# Altium schematic sheet Power.SchDoc
size A4
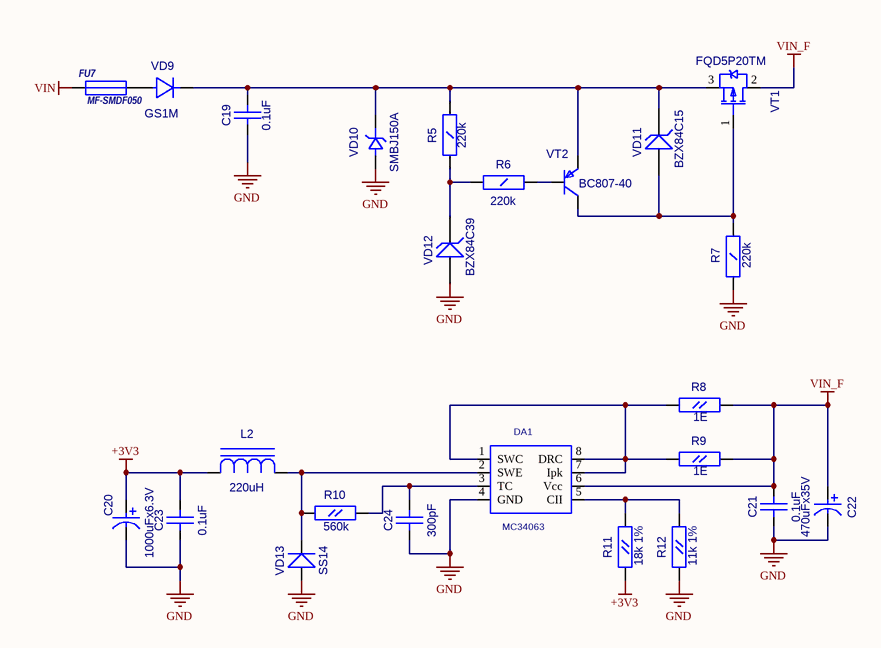
[diagram p0: Power.SchDoc]

## Parts
C19  0.1uF  [CC1206]
C20  1000uFx6.3V  [CC8X3.5]
C21  0.1uF  [CC0603]
C22  470uFx35V  [CC16X10_CAP0.5(1)(Primary)]
C23  0.1uF  [CC0603]
C24  300pF  [CC0603]
DA1  MC34063  [SO-8]
FU7  MF-SMDF050  [MF-SMDF]
L2  220uH  [SDR0805]
R5  220k  [RC1206]
R6  220k  [RC1206]
R7  220k  [RC1206]
R8  1E  [RC0805]
R9  1E  [RC0805]
R10  560k  [RC0603]
R11  18k 1%  [RC0603]
R12  11k 1%  [RC0603]
VD9  GS1M  [SMA]
VD10  SMBJ150A  [SMB]
VD11  BZX84C15  [SOT-23(123)]
VD12  BZX84C39  [SOT-23(123)]
VD13  SS14  [SMA]
VT1  FQD5P20TM  [D-PAK(TO-252AA)]
VT2  BC807-40  [SOT-23(123)]

## Nets
+3V3: C20.1 C23.2(B) L2.1(C) R11.1(A)
GND: C19.1(A) C20.2 C21.1(A) C22.1 C23.1(A) C24.1(A) DA1.4(GND) R7.2(B) R12.1(A) VD10.1(A) VD12.1(A) VD13.1(A)
VIN: FU7.1
VIN_F: C21.2(B) C22.2 DA1.6(Vcc) R8.2(B) R9.2(B) VT1.2(D)
NetC19_2: C19.2(B) R5.2(B) VD9.2(K) VD10.2(K) VD11.3(K) VT1.3(S) VT2.2(E)
NetC24_2: C24.2(B) DA1.3(TC) R10.2(B)
NetDA1_1: DA1.1(SWC) DA1.7(Ipk) DA1.8(DRC) R8.1(A) R9.1(A)
NetDA1_2: DA1.2(SWE) L2.2(A) R10.1(A) VD13.2(K)
NetDA1_5: DA1.5(CII) R11.2(B) R12.2(B)
NetFU7_2: FU7.2 VD9.1(A)
NetR5_1: R5.1(A) R6.1(A) VD12.3(K)
NetR6_2: R6.2(B) VT2.1(B)
NetR7_1: R7.1(A) VD11.1(A) VT1.1(G) VT2.3(C)

## Library data of the parts
C19 = CC1206: Value: 0.1uF
C20 = CAP0.35: Value: 1000uFx6.3V
C21 C23 C24 = CC0603
  C21 C23: Value: 0.1uF
  C24: Value: 300pF
C22 = CAP0.5(1): Value: 470uFx35V
FU7 = MF-SMDF: Value: MF-SMDF050
L2 = SDR0805: Value: 220uH
R5-R7 = RC1206: Value: 220k
R8 R9 = RC0805: Value: 1E
R10-R12 = RC0603
  R10: Value: 560k
  R11: Value: 18k 1%
  R12: Value: 11k 1%
VD9 = GS1M: Value: {Value}
VD10 = SMBJ: Value: SMBJ150A
VD11 VD12 = BZX84: Zener Voltage Regulator Diode; Value: {Value}
VD13 = SS14: Schottky Rectifier; OriginalName: 10BQ100; ComponentField6: Published 8-Jun-2000, Modified 10-July-2000: SIM Model Added.; Value: SS14
VT1 = IRFR9220: HEXFET Power MOSFET; OriginalName: IRLML5103; ComponentField7: Published 8-Jun-2000; Value: FQD5P20TM
VT2 = BC857B: OriginalName: BC846BLT1; ComponentField7: Published 29-Sep-2000; Value: BC807-40
DA1 = MC34063: Value: *